# Altium schematic sheet 03_Power_Supply.SchDoc: -
size A4; Date: -; ApprovedBy: -; CheckedBy: -; Author: -; CompanyName: -; DrawnBy: -; Engineer: -; Organization: Komax AG; Address1: -; Address2: -; Address3: -; Address4: -; DocumentNumber: -; Revision: -; SheetNumber: 3; SheetTotal: 8; KSDP_ObjectName: Power Supply; KSDP_CreatedBy: Patrick Rossacher; KSDP_CreationDate: 15.12.2017; KSDP_ModificationDate: -; KSDP_ModifiedBy: -; CurrentTime: -; CurrentDate: -; Time: -; DocumentFullPathAndName: -; DocumentName: -; ModifiedDate: -; ImagePath: -
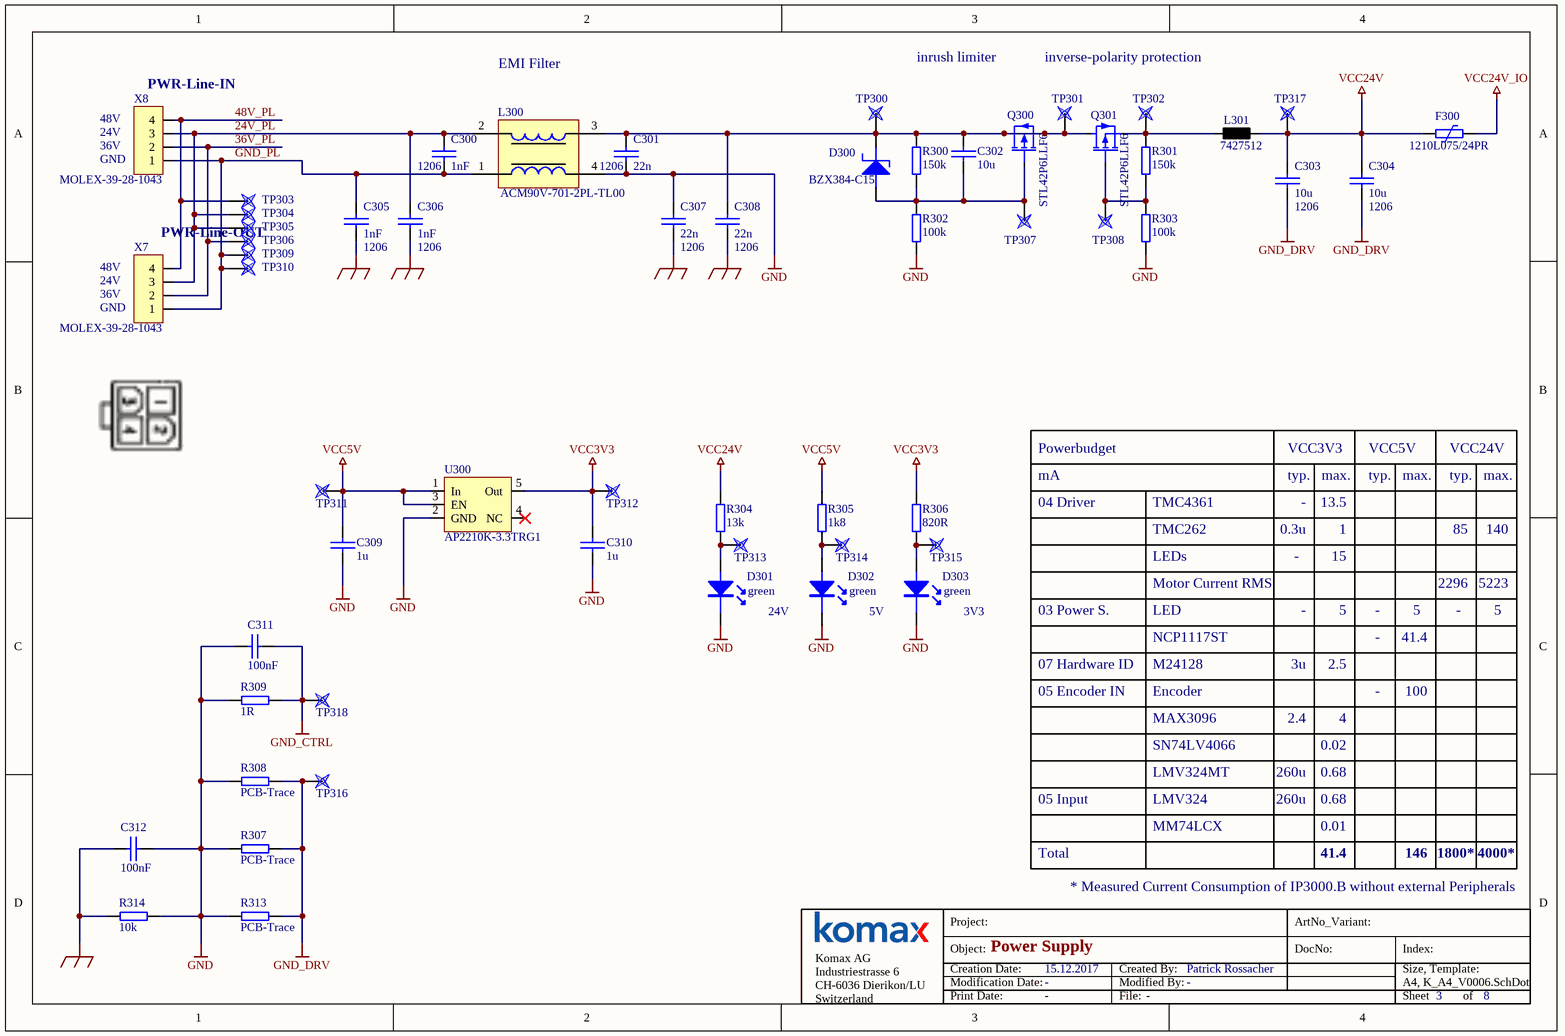
[diagram p0: 03_Power_Supply.SchDoc]

## Parts
C300  1nF  FootprintBOM: 1206  [1206_C]
C301  22n  FootprintBOM: 1206  [1206_C]
C302  10u  [1206_C]
C303  10u  FootprintBOM: 1206  [1206_C]
C304  10u  FootprintBOM: 1206  [1206_C]
C305  1nF  FootprintBOM: 1206  [1206_C]
C306  1nF  FootprintBOM: 1206  [1206_C]
C307  22n  FootprintBOM: 1206  [1206_C]
C308  22n  FootprintBOM: 1206  [1206_C]
C309  1u  [0805_C]
C310  1u  [0805_C]
C311  100nF  [0805_C]
C312  100nF  [0805_C]
D300  BZX384-C15  [SOD-323]
D301  color: green  [0603_led]  (hidden comment: HSMG-C190)
D302  color: green  [0603_led]  (hidden comment: HSMG-C190)
D303  color: green  [0603_led]  (hidden comment: HSMG-C190)
F300  1210L075/24PR  [1210_L]
L300  ACM90V-701-2PL-TL00  [ACM90V]
L301  7427512  [7427512]
Q300  STL42P6LLF6  [PQFN-8_Multi]
Q301  STL42P6LLF6  [PQFN-8_Multi]
R300  150k  [0402_R]
R301  150k  [0402_R]
R302  100k  [0402_R]
R303  100k  [0402_R]
R304  13k  [1206_R]
R305  1k8  [0402_R]
R306  820R  [0402_R]
R307  PCB-Trace  [NET-CONNECT6]  (net tie, no BOM)
R308  PCB-Trace  [NET-CONNECT6]  (net tie, no BOM)
R309  1R  [0805_R]
R313  PCB-Trace  [NET-CONNECT6]  (net tie, no BOM)
R314  10k  [0805_R]
TP300  Testpoint  [TP1.5MM]  (value not drawn)  (no BOM)
TP301  Testpoint  [TP1.5MM]  (value not drawn)  (no BOM)
TP302  Testpoint  [TP1.5MM]  (value not drawn)  (no BOM)
TP303  Testpoint  [TP1.5MM]  (value not drawn)  (no BOM)
TP304  Testpoint  [TP1.5MM]  (value not drawn)  (no BOM)
TP305  Testpoint  [TP1.5MM]  (value not drawn)  (no BOM)
TP306  Testpoint  [TP1.5MM]  (value not drawn)  (no BOM)
TP307  Testpoint  [TP1.5MM]  (value not drawn)  (no BOM)
TP308  Testpoint  [TP1.5MM]  (value not drawn)  (no BOM)
TP309  Testpoint  [TP1.5MM]  (value not drawn)  (no BOM)
TP310  Testpoint  [TP1.5MM]  (value not drawn)  (no BOM)
TP311  Testpoint  [TP1.5MM]  (value not drawn)  (no BOM)
TP312  Testpoint  [TP1.5MM]  (value not drawn)  (no BOM)
TP313  Testpoint  [TP1.5MM]  (value not drawn)  (no BOM)
TP314  Testpoint  [TP1.5MM]  (value not drawn)  (no BOM)
TP315  Testpoint  [TP1.5MM]  (value not drawn)  (no BOM)
TP316  Testpoint  [TP1.5MM]  (value not drawn)  (no BOM)
TP317  Testpoint  [TP1.5MM]  (value not drawn)  (no BOM)
TP318  Testpoint  [TP1.5MM]  (value not drawn)  (no BOM)
U300  AP2210K-3.3TRG1  [SOT23-5]
X7  MOLEX-39-28-1043  [MOLEX-Minifit_4P_90_180deg]
X8  MOLEX-39-28-1043  [MOLEX-Minifit_4P_90_180deg]

## Nets
GND: C301.1 C307.2 C309.2 C310.2 C311.2 C312.1 D301.K D302.K D303.K L300.4 R302.1 R303.1 R307.2 R308.2 R309.2 R313.2 R314.1 U300.2(GND)
GND_CTRL: C311.1 R309.1 TP318.1
GND_DRV: C303.1 C304.1 R307.1 R308.1 R313.1 TP316.1
Shield_3: C305.1 C306.1 C307.1 C308.1 C312.2 R314.2
VCC3V3: C310.1 R306.2 TP312.1 U300.5(Out)
VCC5V: C309.1 R305.2 TP311.1 U300.1(In) U300.3(EN)
VCC24V: C303.2 C304.2 F300.1 L301.2 R304.2 TP317.1
VCC24V_IO: F300.2
24V_PL: C300.2 C306.2 L300.2 TP304.1 TP305.1 X7.3 X8.3
36V_PL: TP306.1 X7.2 X8.2
48V_PL: TP303.1 X7.4 X8.4
GND_PL: C300.1 C305.2 L300.1 TP309.1 TP310.1 X7.1 X8.1
NetC301_2: C301.2 C302.1 C308.2 D300.K L300.3 Q300.D Q300.S Q301.D R300.2 TP300.1 TP301.1
NetC302_2: C302.2 D300.A Q300.G R300.1 R302.2 TP307.1
NetD301_A: D301.A R304.1 TP313.1
NetD302_A: D302.A R305.1 TP314.1
NetD303_A: D303.A R306.1 TP315.1
NetL301_1: L301.1 Q301.S R301.2 TP302.1
NetQ301_G: Q301.G R301.1 R303.2 TP308.1

Not connected (* = marked no-connect by the designer): U300 4(NC)*

## Notes on the sheet
- (near X8) PWR-Line-IN
- EMI Filter
- inrush limiter
- inverse-polarity protection
- (near X8) GND
- (near X8) 36V
- (near X8) 24V
- (near X8) 48V
- (near X7) PWR-Line-OUT
- (near X7) GND
- (near X7) 36V
- (near X7) 24V
- (near X7) 48V
- Powerbudget
- 04 Driver
- mA
- TMC4361
- VCC3V3
- typ.
- -
- max.
- 13.5
- VCC5V
- VCC24V
- TMC262
- LEDs
- 0.3u
- 1
- 15
- 85
- 140
- (near D301) 24V
- 5V
- (near D303) 3V3
- 03 Power S.
- Motor Current RMS
- NCP1117ST
- LED
- 5
- 41.4
- 2296
- 5223
- 07 Hardware ID
- 05 Encoder IN
- M24128
- Encoder
- 3u
- 2.5
- 100
- MAX3096
- SN74LV4066
- LMV324MT
- 2.4
- 260u
- 4
- 0.02
- 0.68
- 05 Input
- MM74LCX
- LMV324
- 0.01
- Total
- 146
- 1800*
- 4000*
- * Measured Current Consumption of IP3000.B without external Peripherals
- Project:
- ArtNo_Variant:
- Object:
- Creation Date:
- Modification Date:
- Created By:
- Modified By:
- DocNo:
- Index:
- Size, Template:
- A4, K_A4_V0006.SchDot
- Komax AG
  Industriestrasse 6
  CH-6036 Dierikon/LU
  Switzerland
- Print Date:
- File:
- Sheet
- of

## Library data of the parts
C300-C308 = CAP: Ceramic Capacitor >=50V X7R
  C302: FootprintBOM: 1206
C309 C310 = CAP: Ceramic Capacitor >=25V; FootprintBOM: 0805
C311 C312 = Cap: Ceramic Capacitor >=50V X7R; FootprintBOM: 0805
D300 = DIODEZENER: ZenerDiode 15V; Manufacturer: NXP; MaxTemp: Tj +150; MinTemp: -55; FootprintBOM: SOD-323
D301-D303 = LED: SMD LED green; Manufacturer: AVAGO; Forward Voltage: 2.2V
F300 = THERMAL FUSE_1: Polyfuse 750mA; Manufacturer: Littlefuse; MaxTemp: +85; MinTemp: -40; FootprintBOM: 1210
L300 = ACM1211-701-2PL-TL01: Common Mode Chokes Dual 700Ohm 100MHz 5A 10mOhm DCR SMD T/R; Manufacturer: TDK; FootprintBOM: ACM90V
L301 = Power_Choke: Ferrit Bead 580Ohm @ 100MHz / 5A; Manufacturer: Würth
Q300 Q301 = MOSFET-P 1G,2x,3S,4D (Diode): P-Channel Power MOSFET, -60V; 3rdSource: FDMS86163P; MaxTemp: 175; MinTemp: -50; Rdson: 26m; 2ndSourcesReleased: DMP6050SPS-13; Bemerkung: *; Distributor: *; FootprintBOM: *; Manufacturer: *; Notes: *; Reference: *; Strategic: *
R300-R303 R305 R306 = RES2: Resistor 0.063W 1%; FootprintBOM: 0402
R304 = RES2: Resistor 0.25W 1%; FootprintBOM: 1206
R307 R308 R313 = RES2: Circuit Path; FootprintBOM: -
R309 R314 = RES2: Resistor 0.125W 1%; FootprintBOM: 0805
TP300-TP318 = P_PRUEFPAD: FootprintBOM: Testpoint
U300 = Linear_Regulator: Linear Voltage Regulator; Manufacturer: Diodes Incorporated; 3rdSource: SPX3819M5-L-3-3/TR; 2ndSourcesReleased: LD2980CM33TR; FootprintBOM: SOT-23-5
X7 X8 = CON_4P: Connector Mini Fit 4p 180°; Manufacturer: Molex; FootprintBOM: THT